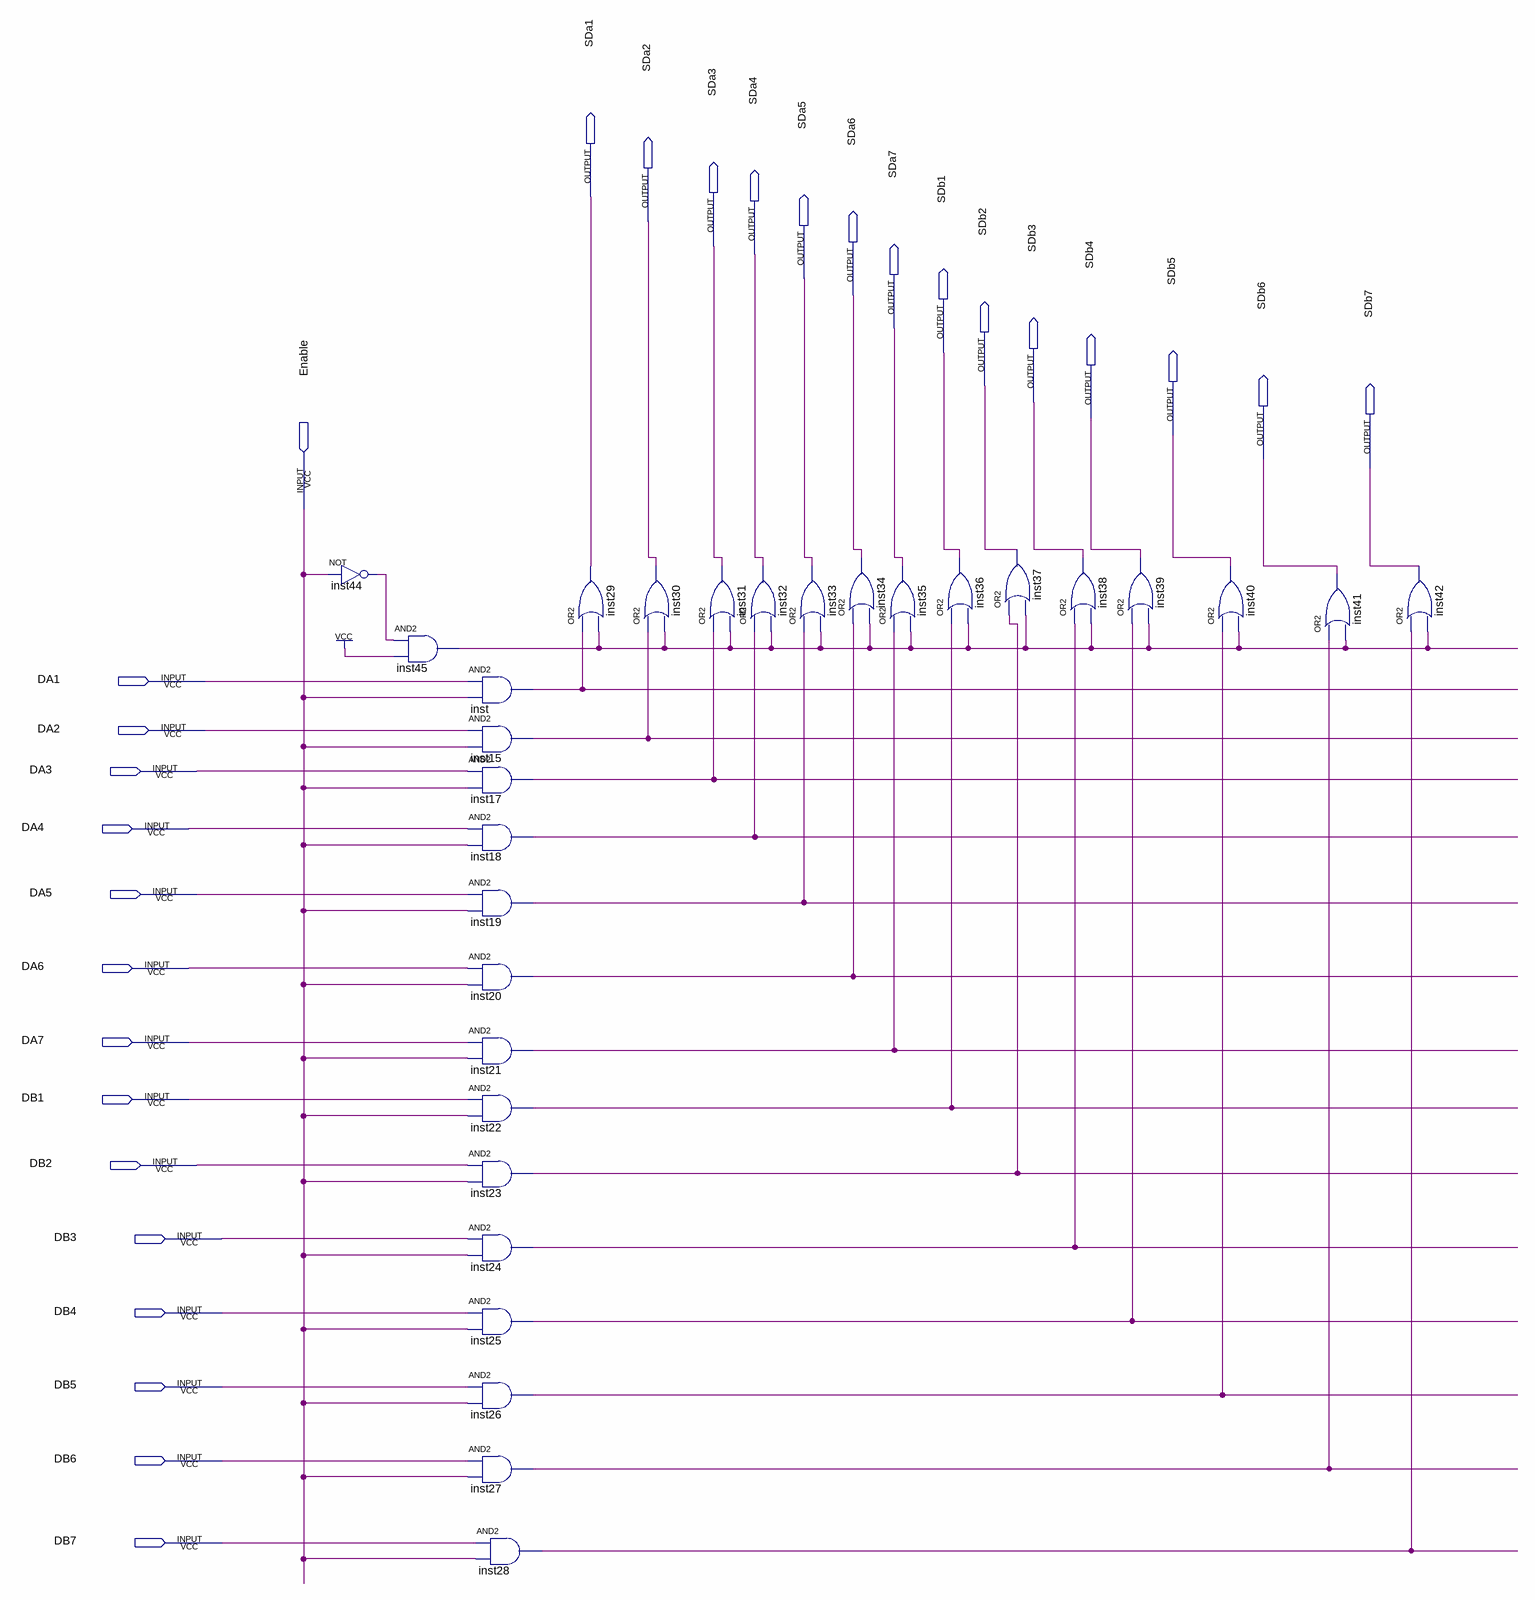
[diagram p0: schematic sheet]
// Quartus schematic terceiromux.bdf as structural Verilog: 30 symbols, 29 pins
module terceiromux (
  input  Enable,
  input  DA1,
  input  DA2,
  input  DA3,
  input  DA4,
  input  DA5,
  input  DA6,
  input  DA7,
  input  DB1,
  input  DB2,
  input  DB3,
  input  DB4,
  input  DB5,
  input  DB6,
  input  DB7,
  output SDa1,
  output SDa2,
  output SDa3,
  output SDa4,
  output SDa5,
  output SDa6,
  output SDa7,
  output SDb1,
  output SDb2,
  output SDb3,
  output SDb4,
  output SDb5,
  output SDb6,
  output SDb7
);

  wire inst15_out, inst17_out, inst18_out, inst19_out, inst20_out, inst21_out, inst22_out, inst23_out,
       inst24_out, inst25_out, inst26_out, inst27_out, inst28_out, inst44_out, inst45_out, inst_out;

  not inst44 (inst44_out, Enable);
  and inst45 (inst45_out, inst44_out, 1'b1);
  and inst (inst_out, DA1, Enable);
  and inst15 (inst15_out, DA2, Enable);
  and inst17 (inst17_out, DA3, Enable);
  and inst18 (inst18_out, DA4, Enable);
  and inst19 (inst19_out, DA5, Enable);
  and inst20 (inst20_out, DA6, Enable);
  and inst21 (inst21_out, DA7, Enable);
  and inst22 (inst22_out, DB1, Enable);
  and inst23 (inst23_out, DB2, Enable);
  and inst24 (inst24_out, DB3, Enable);
  and inst25 (inst25_out, DB4, Enable);
  and inst26 (inst26_out, DB5, Enable);
  and inst27 (inst27_out, DB6, Enable);
  and inst28 (inst28_out, DB7, Enable);
  or inst29 (SDa1, inst_out, inst45_out);
  or inst30 (SDa2, inst15_out, inst45_out);
  or inst31 (SDa3, inst17_out, inst45_out);
  or inst32 (SDa4, inst18_out, inst45_out);
  or inst33 (SDa5, inst19_out, inst45_out);
  or inst34 (SDa6, inst20_out, inst45_out);
  or inst35 (SDa7, inst21_out, inst45_out);
  or inst36 (SDb1, inst22_out, inst45_out);
  or inst37 (SDb2, inst23_out, inst45_out);
  or inst38 (SDb3, inst24_out, inst45_out);
  or inst39 (SDb4, inst25_out, inst45_out);
  or inst40 (SDb5, inst26_out, inst45_out);
  or inst41 (SDb6, inst27_out, inst45_out);
  or inst42 (SDb7, inst28_out, inst45_out);
endmodule
